# EAGLE schematic AC-DC 5V regulator (EAGLE 9.6.2)
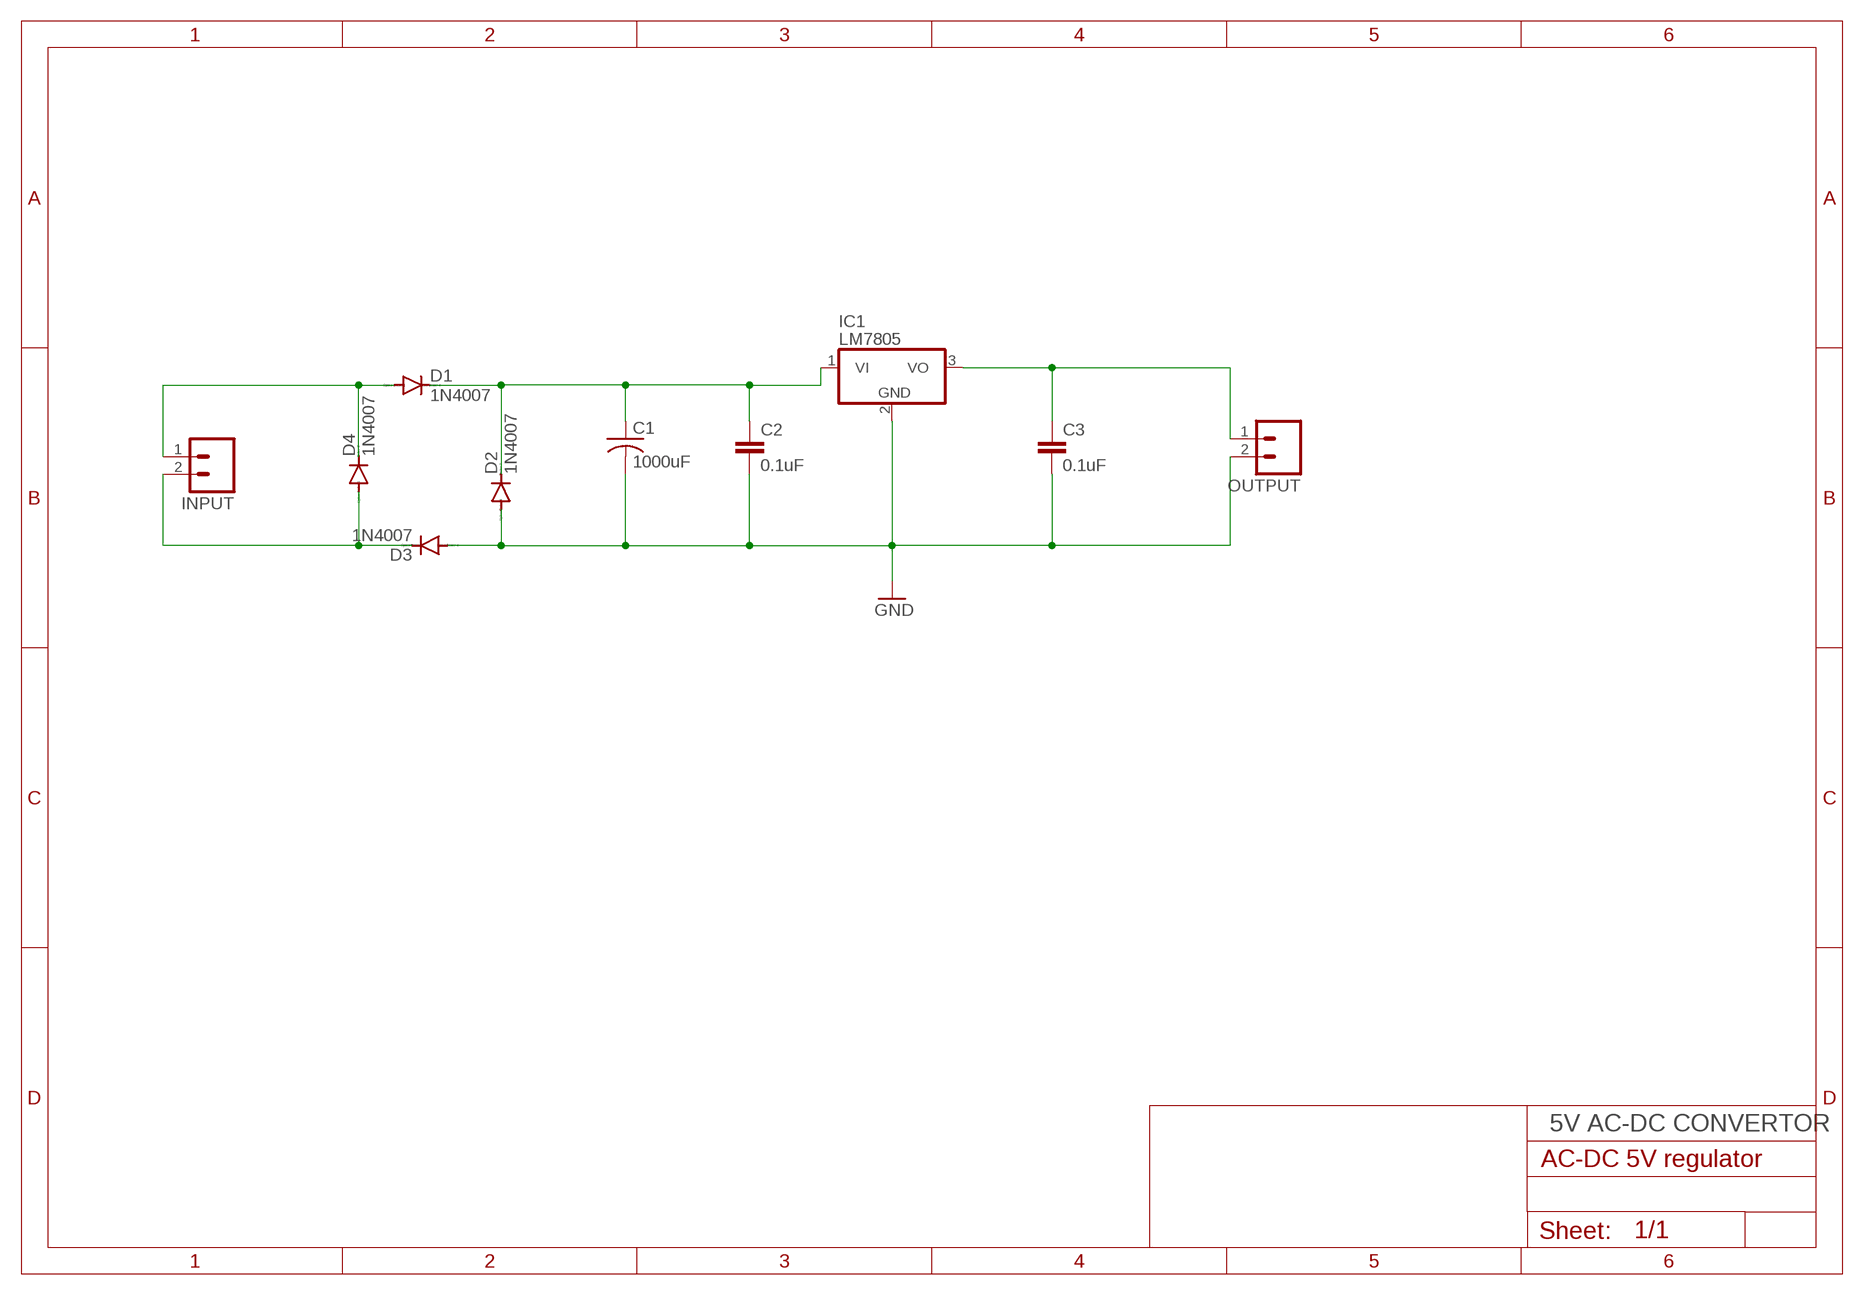
[diagram p0: schematic, sheet 1]

## Parts
C1  1000uF  C-US025-024X044  [C025-024X044]
C2  0.1uF  C-EU025-025X050  [C025-025X050]
C3  0.1uF  C-EU025-025X050  [C025-025X050]
D1  1N4007  1N4004  [DO41-10]
D2  1N4007  1N4004  [DO41-10]
D3  1N4007  1N4004  [DO41-10]
D4  1N4007  1N4004  [DO41-10]
IC1  LM7805  7805TV  [TO220V]
INPUT  M02  [02P]
OUTPUT  M02  [02P]

## Nets
GND: C1.2 C2.2 C3.2 D2.A D3.A IC1.2(GND) OUTPUT.2
N$1: D1.A D4.C INPUT.1
N$2: D3.C D4.A INPUT.2
N$3: C1.1 C2.1 D1.C D2.C IC1.1(VI)
N$4: C3.1 IC1.3(VO) OUTPUT.1

## Notes on the sheet
- 5V AC-DC CONVERTOR

## Library data of the parts
C1 = rcl:C-US: CAPACITOR, American symbol; SPICEPREFIX: C
C2 C3 = rcl:C-EU: CAPACITOR, European symbol; SPICEPREFIX: C
D1-D4 = diode:1N4004: DIODE general purpose rectifier, 1 A
IC1 = linear:78*: Positive VOLTAGE REGULATOR Source: http://cache.national.com/ds/LM/LM78L05.pdf http://www.fairchildsemi.com/ds/LM/LM7805.pdf
INPUT OUTPUT = con-amp-quick:M02: AMP QUICK CONNECTOR; OC_FARNELL: unknown; OC_NEWARK: unknown